# Altium schematic sheet SH32 - POWER INPUT.SchDoc
size 386 x 246 mm
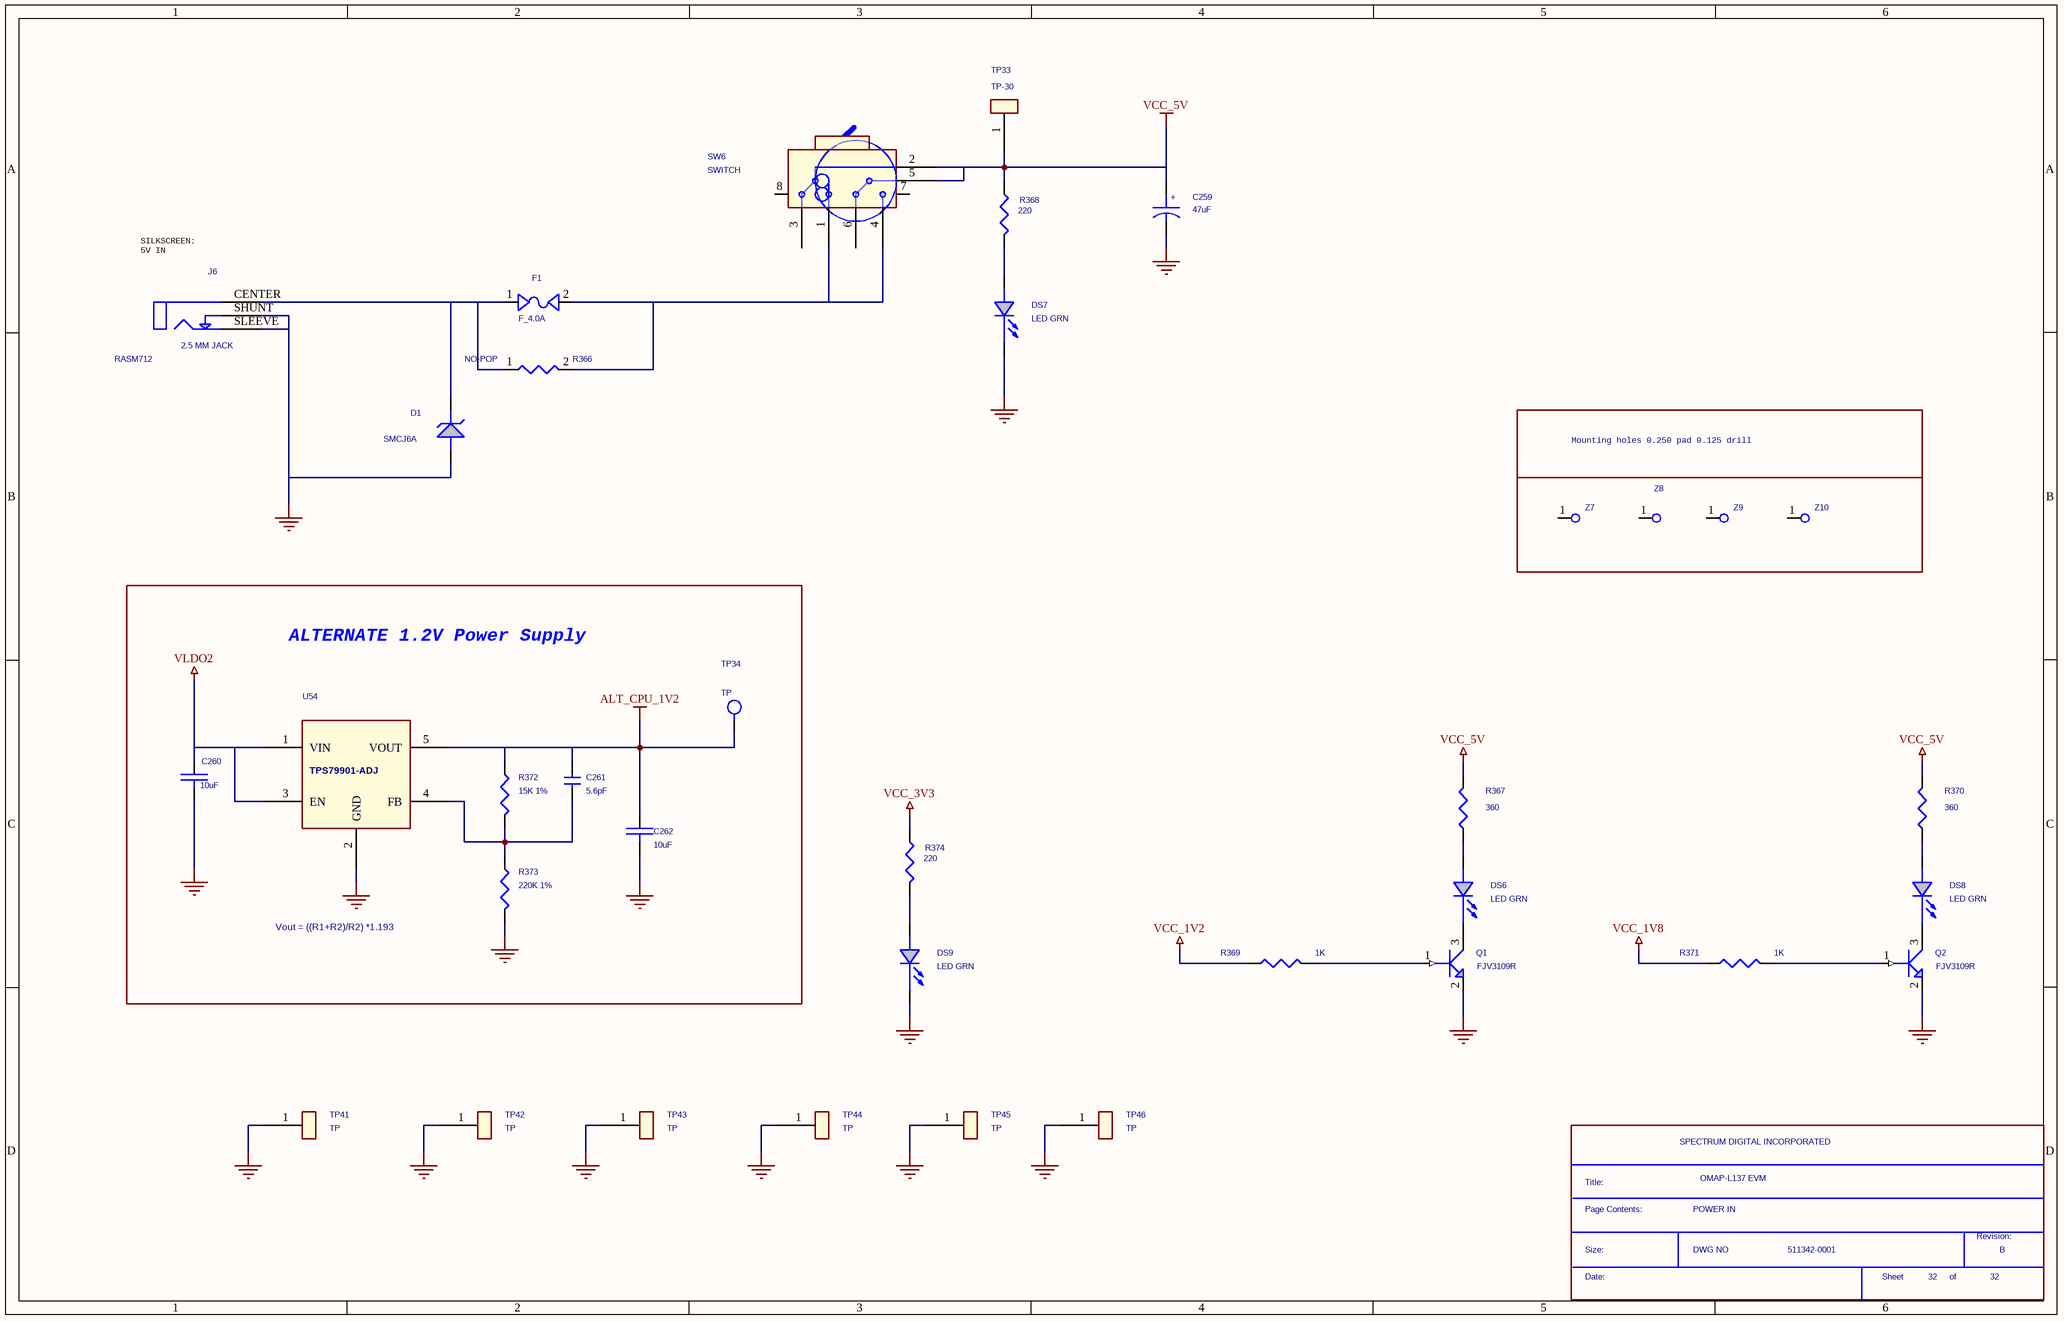
[diagram p0: SH32 - POWER INPUT.SchDoc]

## Parts
*  Page Contents:: POWER IN  RevCode: B  Title: OMAP-L137 EVM  OrgName: SPECTRUM DIGITAL INCORPORATED  Doc: 511342-0001  Page Number: 32  (hidden comment: SDTitleBlock)  (graphical)
C259  47uF  [c7343-84x118]
C260  10uF  [C1206-40X70]
C261  5.6pF  [0603]
C262  10uF  [C1206-40X70]
D1  SMCJ6A  [SMC-DO-214AB]
DS6  LED GRN  [led1206-59x59]
DS7  LED GRN  [led1206-59x59]
DS8  LED GRN  [led1206-59x59]
DS9  LED GRN  [led1206-59x59]
F1  F_4.0A  [SM/F_154]
J6  RASM712  [PWR3-RASM712]
Q1  FJV3109R  [sot23-28x44]
Q2  FJV3109R  [sot23-28x44]
R366  NO-POP  [R2512]
R367  360  [r402-25]
R368  220  [r402-25]
R369  1K  [r402-25]
R370  360  [r402-25]
R371  1K  [r402-25]
R372  15K 1%  [r603-35x45]
R373  220K 1%  [r603-35x45]
R374  220  [r402-25]
SW6  SWITCH  [TGL_2X3]
TP33  TP-30  [CON1]
TP34  TP  [tp1-6040]
TP41  TP  [tp1-6040]
TP42  TP  [tp1-6040]
TP43  TP  [tp1-6040]
TP44  TP  [tp1-6040]
TP45  TP  [tp1-6040]
TP46  TP  [tp1-6040]
U54  TPS79901-ADJ  [SMT-DCQ]
Z7  TestPoint1  [TP1_0-2_0]  (value not drawn)
Z8  MNTHOLE  [TP1_0-2_0]  (value not drawn)
Z9  MNTHOLE  [TP1_0-2_0]  (value not drawn)
Z10  MNTHOLE  [TP1_0-2_0]  (value not drawn)

## Blocks framed on the sheet
Mounting holes 0.250 pad 0.125 drill: Z7-Z10
ALTERNATE 1.2V Power Supply: C260-C262 R372 R373 TP34 U54

## Nets
ALT_CPU_1V2: C261.1 C262.1 R372.1 TP34.1(PIN) U54.5(VOUT)
GND: C259.2 C260.2 C262.2 D1.2(Anode) DS7.1(CATHODE) DS9.1(CATHODE) J6.SHUNT J6.SLEEVE Q1.2(EMITTER) Q2.2(EMITTER) R373.2 TP41.1 TP42.1 TP43.1 TP44.1 TP45.1 TP46.1 U54.2(GND)
VCC_1V2: R369.1
VCC_1V8: R371.1
VCC_3V3: R374.1
VCC_5V: C259.1 R367.2 R368.1 R370.2 SW6.2(COMMON1) SW6.5(COMMON2) TP33.1
VLDO2: C260.1 U54.1(VIN) U54.3(EN)
NetC261_2: C261.2 R372.2 R373.1 U54.4(FB)
NetD1_1: D1.1(Cathode) F1.1(P1) J6.CENTER R366.1
NetDS6_1: DS6.1(CATHODE) Q1.3(COLLECTOR)
NetDS6_2: DS6.2(ANODE) R367.1
NetDS7_2: DS7.2(ANODE) R368.2
NetDS8_1: DS8.1(CATHODE) Q2.3(COLLECTOR)
NetDS8_2: DS8.2(ANODE) R370.1
NetDS9_2: DS9.2(ANODE) R374.2
NetF1_2: F1.2(P2) R366.2 SW6.1(NO1) SW6.4(NO2)
NetQ1_1: Q1.1(BASE) R369.2
NetQ2_1: Q2.1(BASE) R371.2

Not connected (* = marked no-connect by the designer): SW6 3(NC1) 6(NC2) 7(MOUNT) 8(MOUNT2); Z7 1; Z8 1; Z9 1; Z10 1

## Notes on the sheet
- (near J6) SILKSCREEN:
  5V IN
- (near J6) 2.5 MM JACK
- Vout = ((R1+R2)/R2) *1.193
- (in symbol CAP P_0) +
- (in symbol SDTitleBlock) Title:; Page Contents:; Revision:; Size:; DWG NO; Date:; Sheet; of

## Library data of the parts
C259 = CAP P_0: Part #: 100995-0471R; SD PCB Footprint: EIA2816P
C260 C262 = Cap 10uF Cermc 6.3V 20% 1206: 10uF Capacitor, Ceramic, 6.3V, 20%, 1206; Part #: 101003-0101R; MfrNum: JMK316BJ106ML; Mfr: TAIYO YUDEN; VendorNum: 587-1942-1-ND; Vendor: Digikey; Cost100: 0.26; Cost10K: 0.056; SD PCB Footprint: EIA1206; PartName: Cap 10uF Cermc 6.3V 20% 1206; TI Footprint: c1206-40x70
C261 = Cap 100nF Cermc 16V 10% 603: 3pF Capacitor, Ceramic, 16V, 10%, 0402; PartName: Cap 3pF Cermc 16V 10% 402; Part #: 101782-1565R; SD PCB Footprint: EIA0402
D1 = SMCJ6_0.0A: Part #: 101808-0006R; SD PCB Footprint: SMC
DS6-DS9 = LED_2: Part #: 100823-0001R; SD PCB Footprint: EIA1206D
F1 = F_2.5A: Part #: 100872-0004R; SD PCB Footprint: F-SMF-OMNI-BLOK
J6 = PHONEJACK_1: Part #: 101238-0001R
Q1 Q2 = 2N2222_0: Part #: 102109-0001R; SD PCB Footprint: SOT23-NPN
R366 = R_2: Part #: R2512-NOPOP; SD PCB Footprint: EIA0603
R367 R370 = R_0: Part #: 101370-3601R
R368 R374 = R: Resistor, 5%, 1/10W; Part #: 101370-2201R; SD PCB Footprint: EIA0603
R369 R371 = R_0: Part #: 101370-1002R
R372 = R: Part #: 100642-1503R
R373 = R: Part #: 100642-2214R
SW6 = SWITCH_1: Part #: 100601-0001; SD PCB Footprint: DPDTSW
TP33 = TEST POINT_0: Part #: SMT-TP030; SD PCB Footprint: CON1
TP34 = Test Point_1: TEST POINT 0.100; PartName: HEADER 1; Part #: 100115-0001R; Vendor: Digikey; Vendor Nbr: S2111-36-ND; Cost10K: 0.018; Cost100: 0.031; VendorNum: S2011-36-ND; Assy_NO-POP: Do Not Populate; TI Footprint: tp1-6040
TP41-TP46 = TEST POINT
U54 = U-TPS79901 - 1.19 to 6.5V 200mA: Single Output LDO, 200mA, Adj. 1.193 to 6.5V; Part #: 102636-0001R; PartName: U - TPS79901-ADJ LDO; Mfr: TI; MfrNum: TPS79901DDC; TI Footprint: SOT-DDC; Cost10K: 0.3; Cost100: 0.58; VendorNum: 296-17776-1-ND; Vendor: Digikey
Z7-Z10 = TestPoint1: ATLStockNo1: none
* = SDTitleBlock: Page Count: 32